# EAGLE design synthtoy (EAGLE 5.07)
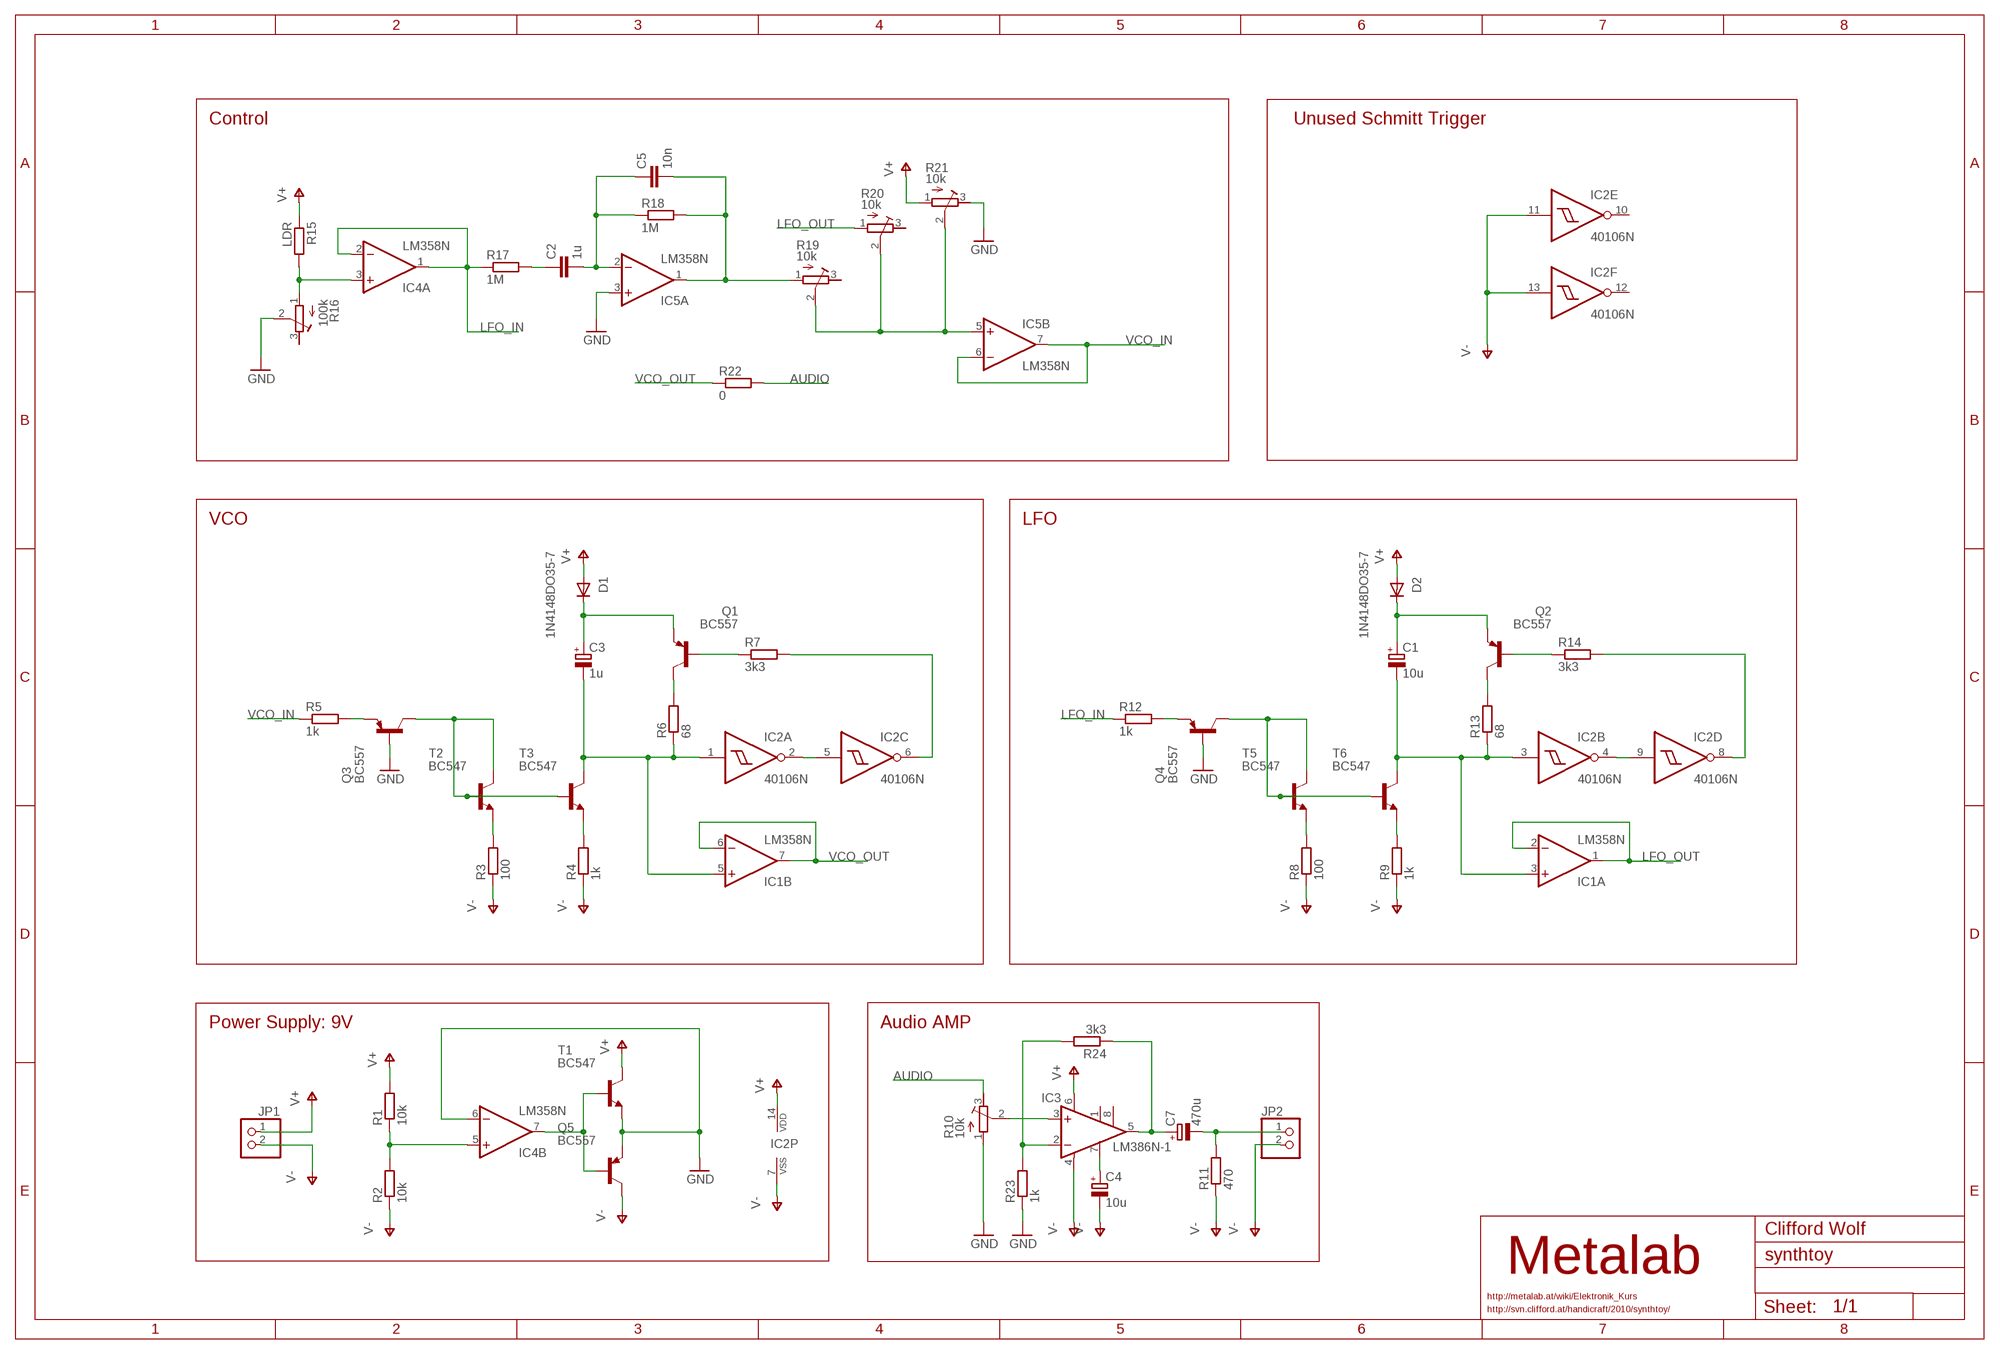
[diagram p0: schematic, sheet 1]

## Parts
C1  10u  CPOL-EUE2-5  [E2-5]
C2  1u  C-EU050-025X075  [C050-025X075]
C3  1u  CPOL-EUE2-5  [E2-5]
C4  10u  CPOL-EUE2-5  [E2-5]
C5  10n  C-EU050-025X075  [C050-025X075]
C7  470u  CPOL-EUE5-10.5  [E5-10,5]
D1  1N4148DO35-7  [DO35-7]
D2  1N4148DO35-7  [DO35-7]
IC1  LM358N  [DIL08]
IC2  40106N  [DIL14]
IC3  LM386N-1  [DIL08]
IC4  LM358N  [DIL08]
IC5  LM358N  [DIL08]
JP1  PINHD-1X2  [1X02]
JP2  PINHD-1X2  [1X02]
Q1  BC557  [TO92]
Q2  BC557  [TO92]
Q3  BC557  [TO92]
Q4  BC557  [TO92]
Q5  BC557  [TO92]
R1  10k  R-EU_0207/10  [0207/10]
R2  10k  R-EU_0207/10  [0207/10]
R3  100  R-EU_0207/10  [0207/10]
R4  1k  R-EU_0207/10  [0207/10]
R5  1k  R-EU_0207/10  [0207/10]
R6  68  R-EU_0207/10  [0207/10]
R7  3k3  R-EU_0207/10  [0207/10]
R8  100  R-EU_0207/10  [0207/10]
R9  1k  R-EU_0207/10  [0207/10]
R10  10k  R-TRIMM3296P  [RTRIM3296P]
R11  470  R-EU_0204/7  [0204/7]
R12  1k  R-EU_0207/10  [0207/10]
R13  68  R-EU_0207/10  [0207/10]
R14  3k3  R-EU_0207/10  [0207/10]
R15  LDR  R-EU_0207/10  [0207/10]
R16  100k  R-TRIMM3296P  [RTRIM3296P]
R17  1M  R-EU_0207/10  [0207/10]
R18  1M  R-EU_0207/10  [0207/10]
R19  10k  R-TRIMM3296P  [RTRIM3296P]
R20  10k  R-TRIMM3296P  [RTRIM3296P]
R21  10k  R-TRIMM3296P  [RTRIM3296P]
R22  0  R-EU_0207/10  [0207/10]
R23  1k  R-EU_0207/10  [0207/10]
R24  3k3  R-EU_0207/10  [0207/10]
T1  BC547  [TO92]
T2  BC547  [TO92]
T3  BC547  [TO92]
T5  BC547  [TO92]
T6  BC547  [TO92]

## Nets
AUDIO: R10.3(A) R22.2
GND: IC4.6(B:-IN) IC5.3(A:+IN) Q3.2(B) Q4.2(B) Q5.1(E) R10.1(E) R16.2(S) R21.3(A) R23.1 T1.1(E)
LFO_IN: IC4.1(A:OUT) IC4.2(A:-IN) R12.1 R17.1
LFO_OUT: IC1.1(A:OUT) IC1.2(A:-IN) R20.1(E)
N$1: IC4.5(B:+IN) R1.1 R2.2
N$2: Q3.1(E) R5.2
N$3: C7.+ IC3.5(OUT) R24.1
N$4: Q3.3(C) T2.2(B) T2.3(C) T3.2(B)
N$5: R3.2 T2.1(E)
N$6: R4.2 T3.1(E)
N$7: C3.- IC1.5(B:+IN) IC2.1(A:I) R6.1 T3.3(C)
N$8: Q1.3(C) R6.2
N$9: C3.+ D1.C Q1.1(E)
N$10: C4.+ IC3.7(BYPASS)
N$11: IC2.6(C:O) R7.2
N$12: Q1.2(B) R7.1
N$13: IC3.3(+IN) R10.2(S)
N$14: Q4.1(E) R12.2
N$15: C7.- JP2.1 R11.2
N$16: Q4.3(C) T5.2(B) T5.3(C) T6.2(B)
N$17: R8.2 T5.1(E)
N$18: R9.2 T6.1(E)
N$19: C1.- IC1.3(A:+IN) IC2.3(B:I) R13.1 T6.3(C)
N$20: Q2.3(C) R13.2
N$21: C1.+ D2.C Q2.1(E)
N$22: IC2.8(D:O) R14.2
N$23: Q2.2(B) R14.1
N$24: IC4.3(A:+IN) R15.2 R16.1(E)
N$25: IC5.5(B:+IN) R19.2(S) R20.2(S) R21.2(S)
N$26: IC2.4(B:O) IC2.9(D:I)
N$27: C2.1 R17.2
N$28: C2.2 C5.1 IC5.2(A:-IN) R18.1
N$29: C5.2 IC5.1(A:OUT) R18.2 R19.1(E)
N$30: IC2.2(A:O) IC2.5(C:I)
N$31: IC3.2(-IN) R23.2 R24.2
N$32: IC4.7(B:OUT) Q5.2(B) T1.2(B)
V+: D1.A D2.A IC2.14(P:VDD) IC3.6(VS) JP1.1 R1.2 R15.1 R21.1(E) T1.3(C)
V-: C4.- IC2.7(P:VSS) IC2.11(E:I) IC2.13(F:I) IC3.4(GND) JP1.2 JP2.2 Q5.3(C) R2.1 R3.1 R4.1 R8.1 R9.1 R11.1
VCO_IN: IC5.6(B:-IN) IC5.7(B:OUT) R5.1
VCO_OUT: IC1.6(B:-IN) IC1.7(B:OUT) R22.1
Unconnected: IC2.10(E:O) IC2.12(F:O) IC3.1(GAIN) IC3.8(GAIN) R16.3(A) R19.3(A) R20.3(A)

## Notes on the sheet
- Control | Unused Schmitt Trigger
- VCO | LFO
- Power Supply: 9V | Audio AMP
- Clifford Wolf
- Metalab
- http://metalab.at/wiki/Elektronik_Kurs
- http://svn.clifford.at/handicraft/2010/synthtoy/

## Power pins joined to a net without a drawn wire
V+: IC1.8(P:V+) IC4.8(P:V+) IC5.8(P:V+)
V-: IC1.4(P:V-) IC4.4(P:V-) IC5.4(P:V-)

## Library data of the parts
C1 C3 C4 C7 = resistor:CPOL-EU: POLARIZED CAPACITOR, European symbol
C2 C5 = resistor:C-EU: CAPACITOR, European symbol
D1 D2 = diode:1N4148: DIODE high speed (Philips)
IC1 IC4 IC5 = linear:LM358: OP AMP also LM158; LM258; LM2904 Source: http://cache.national.com/ds/LM/LM158.pdf
IC2 = 40xx:40106: Hex SCHMITT TRIGGER
IC3 = linear:LM386?-*: Low Voltage Audio Power Amplifier Source: http://cache.national.com/ds/LM/LM386.pdf
JP1 JP2 = pinhead:PINHD-1X2: PIN HEADER
Q1-Q5 = transistor-pnp:BC557: PNP Transistor
R1-R9 R11-R15 R17 R18 R22-R24 = resistor:R-EU_: RESISTOR, European symbol
R10 R16 R19-R21 = resistor:R-TRIMM: Trimm resistor
T1-T3 T5 T6 = transistor:BC547: NPN TRANSISTOR

## Board
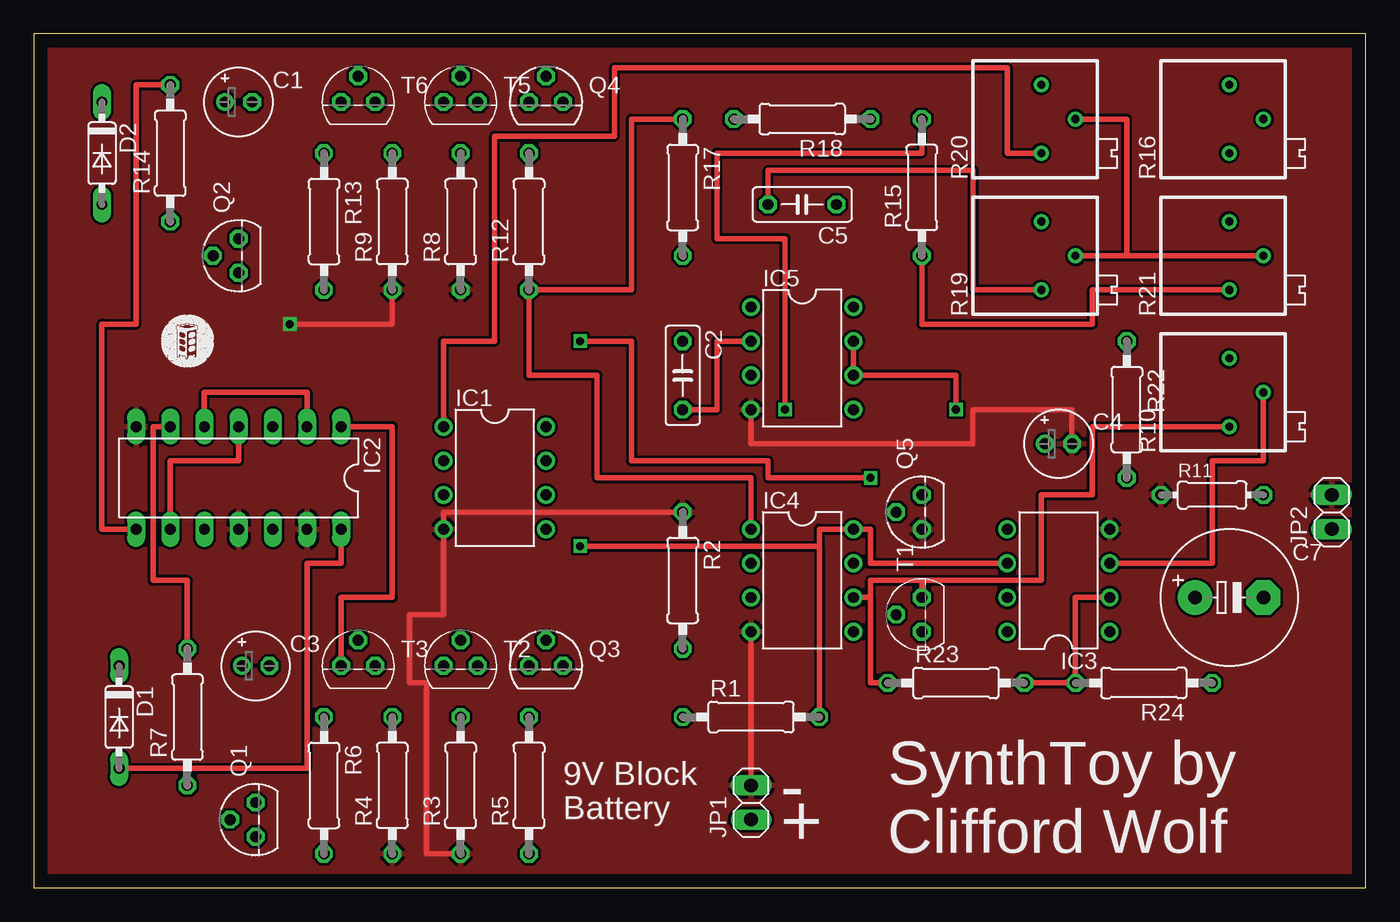
[diagram p1: board, top side]
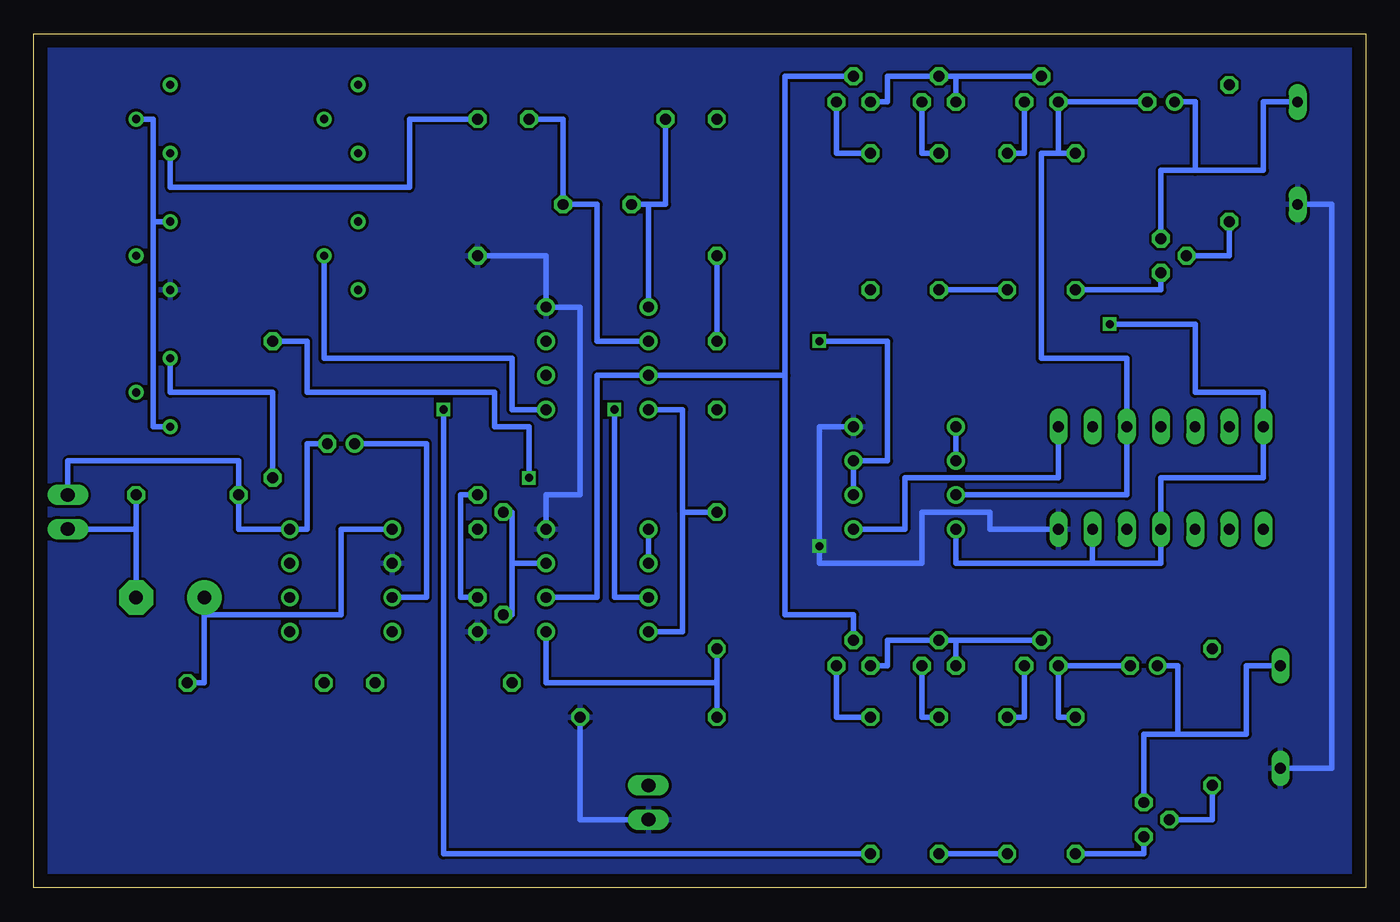
[diagram p2: board, bottom side, seen from below]

Size 99.06 x 63.5 mm. Coordinates in mm from the lower left corner, seen from the top.
Outline: 0,0 99.06,0 99.06,63.5 0,63.5 0,0
Copper layers (1*16): Top 0.035mm / dielectric 1.5mm / Bottom 0.035mm
Design rules "default": minimum track width 10mil, minimum drill 24mil, track to track 8mil, track to pad 8mil, pad to pad 8mil, via to via 8mil, smd to smd 8mil, copper to edge 40mil, drill to drill 8mil, minimum pad ring 10mil, minimum via ring 8mil, stop-mask expansion 4mil, vias tented up to drill 0mil, thermal gap 10mil

### Footprints (pad centres in the part's own frame; a part is rotated, then mirrored left to right if it is on the bottom)
E2-5 = drill 0.813 pad 1.27 round: + -1.016,0 | drill 0.813 pad 1.27 octagon: - 1.016,0
C050-025X075 = drill 0.813 octagon: 1 -2.54,0; 2 2.54,0
E5-10,5 = drill 1.016 pad 2.54 round: + -2.54,0 | drill 1.016 pad 2.54 octagon: - 2.54,0
DO35-7 = drill 0.813 long: A 3.81,0; C -3.81,0
DIL08 = drill 0.813 pad 1.27 round: 1 -3.81,-3.81; 2 -1.27,-3.81; 3 1.27,-3.81; 4 3.81,-3.81; 5 3.81,3.81; 6 1.27,3.81; 7 -1.27,3.81; 8 -3.81,3.81
DIL14 = drill 0.813 long: 1 -7.62,-3.81; 2 -5.08,-3.81; 3 -2.54,-3.81; 4 0,-3.81; 5 2.54,-3.81; 6 5.08,-3.81; 7 7.62,-3.81; 8 7.62,3.81; 9 5.08,3.81; 10 2.54,3.81; 11 0,3.81; 12 -2.54,3.81; 13 -5.08,3.81; 14 -7.62,3.81
1X02 = drill 1.016 long: 1 -1.27,0; 2 1.27,0
TO92 = drill 0.813 octagon: 1 1.27,0; 2 0,1.905; 3 -1.27,0
0207/10 = drill 0.813 octagon: 1 -5.08,0; 2 5.08,0
RTRIM3296P = drill 0.61 round: 1 0,-2.54; 2 2.54,0; 3 0,2.54
0204/7 = drill 0.813 octagon: 1 -3.81,0; 2 3.81,0

### Placement (x,y rotation side)
C1  15.24,58.42 0 top
C2  48.26,38.1 270 top
C3  16.51,16.51 0 top
C4  76.2,33.02 0 top
C5  57.15,50.8 180 top
C7  88.9,21.59 0 top
D1  6.35,12.7 270 top
D2  5.08,54.61 270 top
IC1  34.29,30.48 270 top
IC2  15.24,30.48 180 top
IC3  76.2,22.86 90 top
IC4  57.15,22.86 270 top
IC5  57.15,39.37 270 top
JP1  53.34,6.35 90 top
JP2  96.52,27.94 90 top
Q1  16.51,5.08 90 top
Q2  15.24,46.99 90 top
Q3  38.1,16.51 0 top
Q4  38.1,58.42 0 top
Q5  66.04,27.94 90 top
R1  53.34,12.7 0 top
R2  48.26,22.86 270 top
R3  31.75,7.62 90 top
R4  26.67,7.62 90 top
R5  36.83,7.62 90 top
R6  21.59,7.62 270 top
R7  11.43,12.7 90 top
R8  31.75,49.53 90 top
R9  26.67,49.53 90 top
R10  88.9,36.83 0 top
R11  87.63,29.21 0 top
R12  36.83,49.53 90 top
R13  21.59,49.53 270 top
R14  10.16,54.61 90 top
R15  66.04,52.07 90 top
R16  88.9,57.15 0 top
R17  48.26,52.07 270 top
R18  57.15,57.15 180 top
R19  74.93,46.99 0 top
R20  74.93,57.15 0 top
R21  88.9,46.99 0 top
R22  81.28,35.56 270 top
R23  68.58,15.24 0 top
R24  82.55,15.24 180 top
T1  66.04,20.32 90 top
T2  31.75,16.51 0 top
T3  24.13,16.51 0 top
T5  31.75,58.42 0 top
T6  24.13,58.42 0 top
U$1  [METALAB]  11.43,40.64 0 top

### Tracks (layer width: path | path; a pad name or v marks a point on that pad's centre or on a via)
AUDIO
  Bottom 0.406: R22.2 81.28,36.83 88.9,36.83 R10.3
GND
  Top 0.406: R10.1 78.74,34.29 78.74,29.21 74.93,29.21 74.93,22.86 66.04,22.86 | 66.04,22.86 62.23,22.86 62.23,21.59 | IC4.6 62.23,21.59 | R23.1 62.23,15.24 62.23,21.59 | 66.04,22.86 T1.1
  Bottom 0.406: 43.18,38.1 43.18,20.32 38.1,20.32 Q3.2 | 43.18,38.1 43.18,60.33 Q4.2 | 90.17,49.53 90.17,34.29 R10.1 | 90.17,49.53 R21.3 | 90.17,49.53 90.17,57.15 R16.2 | 43.18,38.1 IC5.3 57.15,38.1 57.15,21.59 IC4.6 | Q5.1 67.31,29.21 67.31,21.59 T1.1
LFO_IN
  Top 0.406: R17.1 44.45,57.15 44.45,44.45 R12.1 36.83,38.1 41.91,38.1 41.91,30.48 53.34,30.48 IC4.1
  Bottom 0.406: IC4.1 IC4.2
LFO_OUT
  Top 0.406: R20.1 72.39,54.61 72.39,60.96 43.18,60.96 43.18,55.88 34.29,55.88 34.29,40.64 30.48,40.64 IC1.1
  Bottom 0.406: IC1.2 IC1.1
N$1
  Bottom 0.406: R1.1 48.26,15.24 | 48.26,15.24 R2.2 | IC4.5 60.96,15.24 48.26,15.24
N$2
  Bottom 0.406: Q3.1 39.37,12.7 R5.2
N$3
  Bottom 0.406: IC3.5 76.2,26.67 76.2,20.32 86.36,20.32 C7.+ 86.36,15.24 R24.1
N$4
  Bottom 0.406: T3.2 30.48,18.41 | 30.48,18.41 T2.2 35.56,18.41 35.56,16.51 Q3.3 | 30.48,18.41 T2.3
N$5
  Bottom 0.406: R3.2 33.02,12.7 T2.1
N$6
  Bottom 0.406: R4.2 25.4,12.7 T3.1
N$7
  Top 0.406: T3.3 22.86,21.59 26.67,21.59 26.67,34.29 IC2.1
  Bottom 0.406: R6.1 22.86,12.7 T3.3 C3.- | IC1.5 34.29,26.67 34.29,30.48 22.86,30.48 IC2.1
N$8
  Bottom 0.406: R6.2 16.51,2.54 Q1.3
N$9
  Bottom 0.406: C3.+ 13.97,16.51 13.97,11.43 | 13.97,11.43 16.51,11.43 Q1.1 | D1.C 8.89,16.51 8.89,11.43 13.97,11.43
N$10
  Bottom 0.406: C4.+ 69.85,33.02 69.85,21.59 IC3.7
N$11
  Top 0.406: R7.2 11.43,22.86 8.89,22.86 8.89,34.29 IC2.6
N$12
  Bottom 0.406: Q1.2 11.43,5.08 R7.1
N$13
  Top 0.406: IC3.3 87.63,24.13 87.63,31.75 91.44,31.75 R10.2
N$14
  Bottom 0.406: Q4.1 39.37,54.61 R12.2
N$15
  Bottom 0.406: C7.- 91.44,26.67 | 91.44,26.67 R11.2 | 91.44,26.67 JP2.1
N$16
  Bottom 0.406: T6.2 30.48,60.33 | 30.48,60.33 T5.2 35.56,60.33 35.56,58.42 Q4.3 | 30.48,60.33 T5.3
N$17
  Bottom 0.406: R8.2 33.02,54.61 T5.1
N$18
  Bottom 0.406: R9.2 25.4,54.61 T6.1
N$19
  Bottom 0.406: C1.- T6.3 22.86,54.61 | 22.86,54.61 R13.1 | IC1.3 17.78,29.21 IC2.3 17.78,39.37 24.13,39.37 24.13,54.61 22.86,54.61
N$20
  Bottom 0.406: R13.2 15.24,44.45 Q2.3
N$21
  Bottom 0.406: D2.C 7.62,58.42 7.62,53.34 12.7,53.34 | 12.7,53.34 12.7,58.42 C1.+ | Q2.1 15.24,53.34 12.7,53.34
N$22
  Top 0.406: R14.2 7.62,59.69 7.62,41.91 5.08,41.91 5.08,26.67 IC2.8
N$23
  Bottom 0.406: Q2.2 10.16,46.99 R14.1
N$24  (via drill 0.6)
  Top 0.406: v55.88,35.56 55.88,48.26 50.8,48.26 50.8,54.61 66.04,54.61 R15.2
  Bottom 0.406: R16.1 88.9,52.07 71.12,52.07 71.12,57.15 R15.2 | IC4.3 55.88,21.59 v55.88,35.56
N$25
  Top 0.406: R19.2 81.28,46.99 | 81.28,46.99 R21.2 | R20.2 81.28,57.15 81.28,46.99
  Bottom 0.406: IC5.5 63.5,35.56 63.5,39.37 77.47,39.37 R19.2
N$26
  Top 0.406: IC2.9 10.16,31.75 15.24,31.75 IC2.4
N$27
  Bottom 0.406: C2.1 R17.2
N$28
  Top 0.406: IC5.2 50.8,40.64 50.8,35.56 C2.2
  Bottom 0.406: R18.1 59.69,57.15 C5.1 57.15,50.8 57.15,40.64 IC5.2
N$29
  Top 0.406: C5.2 54.61,53.34 69.85,53.34 69.85,44.45 R19.1
  Bottom 0.406: 53.34,50.8 C5.2 | IC5.1 53.34,50.8 | R18.2 52.07,50.8 53.34,50.8
N$30
  Top 0.406: IC2.5 12.7,36.83 20.32,36.83 IC2.2
N$31
  Top 0.406: R23.2 R24.2 77.47,21.59 IC3.2
N$32
  Bottom 0.406: Q5.2 63.5,27.94 63.5,24.13 | 63.5,24.13 63.5,20.32 T1.2 | 63.5,24.13 IC4.7
V+  (via drill 0.6)
  Top 0.406: IC2.14 22.86,24.13 20.32,24.13 20.32,8.89 D1.A | 58.42,25.4 R1.2 | IC3.6 62.23,24.13 62.23,26.67 IC4.8 58.42,26.67 58.42,25.4 | v40.64,25.4 58.42,25.4 | R21.1 78.74,44.45 78.74,41.91 66.04,41.91 R15.1
  Bottom 0.406: IC2.14 27.94,26.67 27.94,27.94 33.02,27.94 33.02,24.13 40.64,24.13 v40.64,25.4 40.64,34.29 IC1.8 | R15.1 60.96,46.99 IC5.8 58.42,43.18 58.42,29.21 60.96,29.21 IC4.8 | D2.A 2.54,50.8 2.54,8.89 D1.A | R1.2 58.42,5.08 JP1.1
  pour Bottom: 0,63.5 99.06,63.5 99.06,0 0,0
V-  (via drill 0.6)
  Top 0.406: R3.1 29.21,2.54 29.21,15.24 27.94,15.24 27.94,20.32 30.48,20.32 IC1.4 30.48,27.94 R2.1 | R9.1 26.67,41.91 v19.05,41.91 | IC4.4 JP1.2 | IC5.4 53.34,33.02 69.85,33.02 69.85,35.56 77.22,35.56 C4.-
  Bottom 0.406: JP2.2 96.52,31.75 83.82,31.75 R11.1 83.82,26.67 IC3.4 78.74,26.67 78.74,33.02 C4.- | R4.1 R3.1 | R9.1 R8.1 | 20.32,24.13 IC2.13 | 20.32,24.13 15.24,24.13 IC2.11 15.24,30.48 7.62,30.48 IC2.7 7.62,36.83 12.7,36.83 12.7,41.91 v19.05,41.91 | IC1.4 30.48,24.13 20.32,24.13 | IC4.4 50.8,19.05 50.8,27.94 | R2.1 50.8,27.94 | IC5.4 50.8,35.56 50.8,27.94
  pour Top: 0,63.5 99.06,63.5 99.06,0 0,0
VCO_IN  (via drill 0.6)
  Top 0.406: v68.58,35.56 68.58,38.1 IC5.6 IC5.7
  Bottom 0.406: R5.1 68.58,2.54 v68.58,35.56
VCO_OUT  (via drill 0.6)
  Top 0.406: v62.23,30.48 54.61,30.48 54.61,31.75 44.45,31.75 44.45,40.64 v40.64,40.64
  Bottom 0.406: IC1.6 IC1.7 35.56,31.75 35.56,40.64 v40.64,40.64 | R22.1 78.74,40.64 78.74,36.83 64.77,36.83 64.77,34.29 62.23,34.29 v62.23,30.48

### Text on the board
tPlace: 9V Block | SynthToy by | - | Battery | + | Clifford Wolf